# Altium schematic sheet VCU-S04-V00-PSU5V.SchDoc: Power Supply (9-25V to 5V @ 0.1-0.3A)
size A3; DrawnBy: Jonn Dillon; DocumentNumber: 11; Revision: 01; SheetNumber: 8; SheetTotal: 9; Version: 01; Project: Chassis Controller (Interim) 2020; PageSetup: Record=PageOptions|CenterHorizontal=True|CenterVertical=True|PrintScale=0.97|XCorrection=1.00|YCorrection=1.00|PrintKind=0|BorderSize=5000000|LeftOffset=0|BottomOffset=0|Orientation=2|PaperLength=1000|PaperWidth=1000|Scale=100|PaperSource=7|PrintQuality=-4|MediaType=1|DitherType=10|PaperKind=A4|PrintScaleMode=1
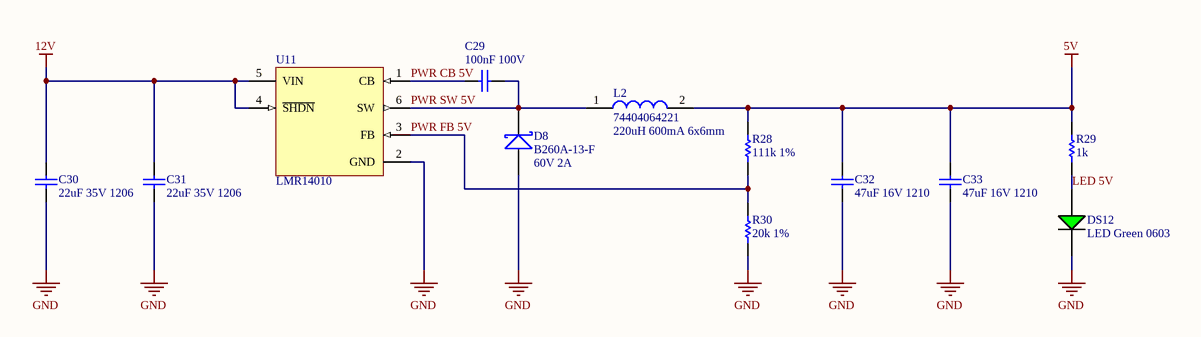
[diagram p0: VCU-S04-V00-PSU5V.SchDoc]

## Parts
C29  100nF 100V  [Cap_Ceramic_0603]
C30  22uF 35V 1206  [Cap_Ceramic_1206]
C31  22uF 35V 1206  [Cap_Ceramic_1206]
C32  47uF 16V 1210  [Cap_Ceramic_1210]
C33  47uF 16V 1210  [Cap_Ceramic_1210]
D8  B260A-13-F  [SMA]
DS12  LED Green 0603  [LED GREEN 0603]
L2  74404064221  [Inductor_6x6mm]
R28  111k 1%  [Res_ThinFilm_0603]
R29  1k  [Res_ThinFilm_0603]
R30  20k 1%  [Res_ThinFilm_0603]
U11  LMR14010  [LMR14010]

## Nets
5V: C32.2 C33.2 L2.2 R28.2 R29.2
12V: C30.2 C31.2 U11.4(~{SHDN}) U11.5(VIN)
GND: C30.1 C31.1 C32.1 C33.1 D8.A DS12.2(C) R30.1 U11.2(GND)
LED 5V: DS12.1(A) R29.1
PWR CB 5V: C29.1 U11.1(CB)
PWR FB 5V: R28.1 R30.2 U11.3(FB)
PWR SW 5V: C29.2 D8.K L2.1 U11.6(SW)

## Notes on the sheet
- (near L2) 220uH 600mA 6x6mm
- (near D8) 60V 2A
- Title
- Size:
- Date:
- A3
- Number:
- Time:
- Revision:
- Sheet
- of
- File:

## Library data of the parts
C29 = 100nF 100V 5% X7R 0603: Capacitor, Ceramic, SMD, 100nF, 100V, 5%, X7R, 0603
C30 C31 = 22uF 35V 10% X7R 1206: Capacitor, Ceramic, SMD, 22uF, 35V, 10%, X7R, 1206
C32 C33 = 47uF 16V 10% X7R 1210: Capacitor, Ceramic, SMD, 47uF, 16V, 5%, X7R, 1210
D8 = B260A-13-F: Diode, Schottky Barrier Rectifier, 60 V, 2 A, B260A-13-F
L2 = 74404064221: FIXED IND 220UH 660MA 850 MOHM; ComponentLink1Description: Digikey; ComponentLink1URL: https://www.digikey.com.au/product-detail/en/w%C3%BCrth-elektronik/74404064221/732-7261-1-ND/5353241; ComponentLink2Description: LCSC A; ComponentLink2URL: https://lcsc.com/product-detail/Power-Inductors_Sunlord-SWPA6045S221MT_C91047.html; ComponentLink3Description: LCSC B; ComponentLink3URL: https://lcsc.com/product-detail/Power-Inductors_SXN-Shun-Xiang-Nuo-Elec-SMNR6045-221MT_C467145.html
R28 = 111k 1% 0603: Resistor, SMD, 111k, 0.1W, 5%, 0603
R29 = 1k 5% 0603: Resistor, SMD, 1k, 0.1W, 5%, 0603
R30 = 20k 1% 0603: Resistor, SMD, 20k, 0.1W, 1%, 0603